# Altium schematic sheet DLY-056-13V_3A-KP212_电源原理图.SchDoc
size A4
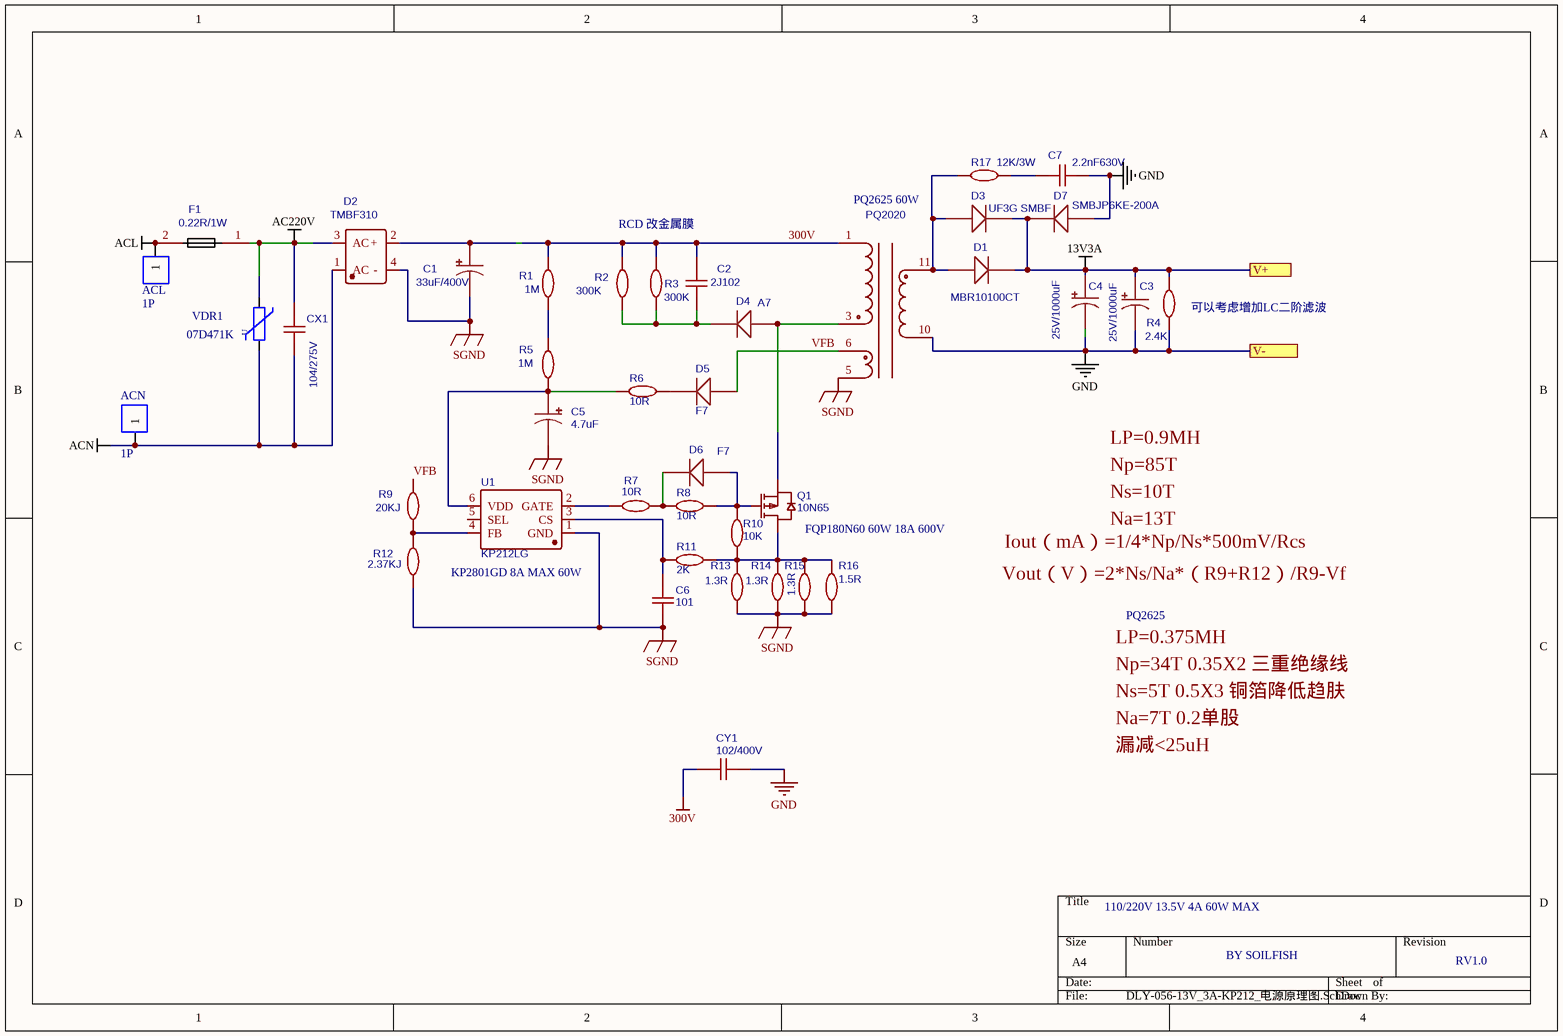
[diagram p0: DLY-056-13V_3A-KP212_电源原理图.SchDoc]

## Parts
ACL  1P  [TEST3.0_top]
ACN  1P  [TEST3.0_top]
C1  33uF/400V  [DIP-EC5.0X12.5X20-A]
C2  2J102  [SMT-1206C]
C3  25V/1000uF  [DIP-EC3.5X8X11.5-A]
C4  25V/1000uF  [DIP-EC3.5X8X11.5-A]
C5  4.7uF  [DIP-EC2.5X5X11]
C6  101  [0805_C]
C7  2.2nF630V  [SMT-1206C]
CX1  104/275V  [AII-C10X5-5]
CY1  102/400V  [MI-CY11.5X4.5-10]
D1  MBR10100CT  [SMT-TO252锡膏-二极管]
D2  TMBF310  [DBS]
D3  UF3G SMBF  [SMT-TO252锡膏-二极管]
D4  A7  [SMA(DO-214AC)_S1]
D5  F7  [SMT-SOD123锡膏]
D6  F7  [SMT-SOD123锡膏]
D7  SMBJP6KE-200A  [SMT-TO252锡膏-二极管]
F1  0.22R/1W  [AI-R11X4-15]
Q1  10N65  [TO-220带散热片-MOS]
R1  1M  [1206_r]
R2  300K  [1206_r]
R3  300K  [1206_r]
R4  2.4K  [0805_r]
R5  1M  [1206_r]
R6  10R  [0805_r]
R7  10R  [0805_r]
R8  10R  [0805_r]
R9  20KJ  [0805_r]
R10  10K  [0805_r]
R11  2K  [0805_r]
R12  2.37KJ  [0805_r]
R13  1.3R  [SMT-1206]
R14  1.3R  [SMT-1206]
R15  1.3R  [SMT-1206]
R16  1.5R  [SMT-1206]
R17  12K/3W  [0805_r]
T1  PQ2020  [EC22-13-1]
U1  KP212LG  [SOT-23-6]
VDR1  07D471K  [MI-C7.5X5-5]

## Ports
V+, V-

## Nets
13V3A: C3.1 C4.1 D1.2(C) D3.2(C) D7.2(C) R4.1 ; port V+
300V: C1.1 C2.2 CY1.2 D2.2(+) R1.2 R2.2 R3.2 T1.1
AC220V: CX1.2 D2.3(AC) F1.1 VDR1.2
ACL: ACL.1 F1.2
ACN: ACN.1 CX1.1 D2.1(AC) VDR1.1
GND: C3.2 C4.2 C7.1 CY1.1 D7.1(A) R4.2 T1.10 ; port V-
SGND: C1.2 C5.2 C6.1 D2.4(-) R12.2 R13.1 R14.1 R15.1 R16.1 T1.5 U1.1(GND)
VFB: D5.1(A) R9.1 T1.6
NetC2_1: C2.1 D4.2(C) R2.1 R3.1
NetC5_1: C5.1 R5.1 R6.2 U1.6(VDD)
NetC6_2: C6.2 R11.2 U1.3(CS)
NetC7_2: C7.2 R17.2
NetD1_1: D1.1(A) D3.1(A) R17.1 T1.11
NetD4_1: D4.1(A) Q1.D T1.3
NetD5_2: D5.2(k) R6.1
NetD6_1: D6.1(A) Q1.G R8.1 R10.1
NetD6_2: D6.2(C) R7.1 R8.2
NetQ1_S: Q1.S R10.2 R11.1 R13.2 R14.2 R15.2 R16.2
NetR1_1: R1.1 R5.2
NetR7_2: R7.2 U1.2(GATE)
NetR9_2: R9.2 R12.1 U1.4(FB)

Not connected (* = marked no-connect by the designer): U1 5(SEL)

## Notes on the sheet
- RCD 改金属膜
- PQ2625 60W
- (near R4) 可以考虑增加LC二阶滤波
- LP=0.9MH
- Np=85T
- Ns=10T
- KP2801GD 8A MAX 60W
- FQP180N60 60W 18A 600V
- Vout（V）=2*Ns/Na*（R9+R12）/R9-Vf
- Iout（mA）=1/4*Np/Ns*500mV/Rcs
- Na=13T
- LP=0.375MH
- PQ2625
- Np=34T 0.35X2 三重绝缘线
- Ns=5T 0.5X3 铜箔降低趋肤
- Na=7T 0.2单股
- 漏减<25uH
- 110/220V 13.5V 4A 60W MAX
- BY SOILFISH
- RV1.0
- (in symbol ZNR) U

## Library data of the parts
C1 C5 = 4.7uF: BOM_Manufacturer: KNSCHA; BOM_Manufacturer Part: 01EC0069SHG4.7uF400V; nameAlias: Capacitance; Contributor: LCSC; BOM_Supplier: LCSC; BOM_Supplier Part: C503210; spicePre: C; spiceSymbolName: 01EC0069SHG4.7UF400V
C2 C6 C7 CX1 = 102/400V: BOM_Manufacturer: SAMSUNG; BOM_Manufacturer Part: CL10B104KA8NNNC; nameAlias: Capacitance; BOM_Supplier: LCSC; BOM_Supplier Part: C1590; spicePre: C; spiceSymbolName: CL10B104KA8NNNC
C3 C4 = 680uF: BOM_Manufacturer: KNSCHA; BOM_Manufacturer Part: 01EC0069SHG4.7uF400V; nameAlias: Capacitance; Contributor: LCSC; BOM_Supplier: LCSC; BOM_Supplier Part: C503210; spicePre: C; spiceSymbolName: 01EC0069SHG4.7UF400V
CY1 = 471/100V: BOM_Manufacturer: SAMSUNG; BOM_Manufacturer Part: CL10B104KA8NNNC; nameAlias: Capacitance; BOM_Supplier: LCSC; BOM_Supplier Part: C1590; spicePre: C; spiceSymbolName: CL10B104KA8NNNC
D1 D3-D7 = A7: BOM_Manufacturer: DIODES; BOM_Manufacturer Part: 1N4148WSF-7; Contributor: LCSC; BOM_Supplier: LCSC; BOM_Supplier Part: C119617; spicePre: D; spiceSymbolName: 1N4148WSF-7
D2 = MB10F(0.8A): BOM_Manufacturer: Youtai Semiconductor Co., Ltd.; Contributor: LCSC; BOM_Supplier: LCSC; BOM_Supplier Part: C347350; BOM_Manufacturer Part: MB10F(0.8A); spicePre: D; spiceSymbolName: MB10F(0.8A)
F1 = 2A/250V: BOM_Manufacturer: XCFuse; BOM_Supplier: LCSC; BOM_Supplier Part: C36902; spicePre: F; spiceSymbolName: 6.3A/250V
Q1 = 3401: BOM_Manufacturer: GOFORD; Contributor: LCSC; BOM_Supplier: LCSC; BOM_Supplier Part: C239055; BOM_Manufacturer Part: 3401; spicePre: Q; spiceSymbolName: 3401
R1 R3 R5-R12 = 300K: BOM_Manufacturer: Tyohm; BOM_Manufacturer Part: RMC04024.7K1%N; nameAlias: Resistance (Ohms); Contributor: LCSC; BOM_Supplier: LCSC; BOM_Supplier Part: C270129; spicePre: R; spiceSymbolName: RMC04024.7K1%N
R2 = 120R: BOM_Manufacturer: Tyohm; BOM_Manufacturer Part: RMC04024.7K1%N; nameAlias: Resistance (Ohms); Contributor: LCSC; BOM_Supplier: LCSC; BOM_Supplier Part: C270129; spicePre: R; spiceSymbolName: RMC04024.7K1%N
R4 R17 = 6.8K: BOM_Manufacturer: Tyohm; BOM_Manufacturer Part: RMC04024.7K1%N; nameAlias: Resistance (Ohms); Contributor: LCSC; BOM_Supplier: LCSC; BOM_Supplier Part: C270129; spicePre: R; spiceSymbolName: RMC04024.7K1%N
R13-R16 = 10K: BOM_Manufacturer: Tyohm; BOM_Manufacturer Part: RMC04024.7K1%N; nameAlias: Resistance (Ohms); Contributor: LCSC; BOM_Supplier: LCSC; BOM_Supplier Part: C270129; spicePre: R; spiceSymbolName: RMC04024.7K1%N
T1 = EFD2020: Contributor: RICK-SHEN; spicePre: U; spiceSymbolName: EE1310-3783
U1 = HTX1820: BOM_Manufacturer: FM; BOM_Manufacturer Part: 8205SS; BOM_Supplier: LCSC; BOM_Supplier Part: C108055; spicePre: Q; spiceSymbolName: 8205SS
VDR1 = ZNR